# EAGLE design LPC_AP2_3_BOPLA PK 101-111.43 (EAGLE 5.06)
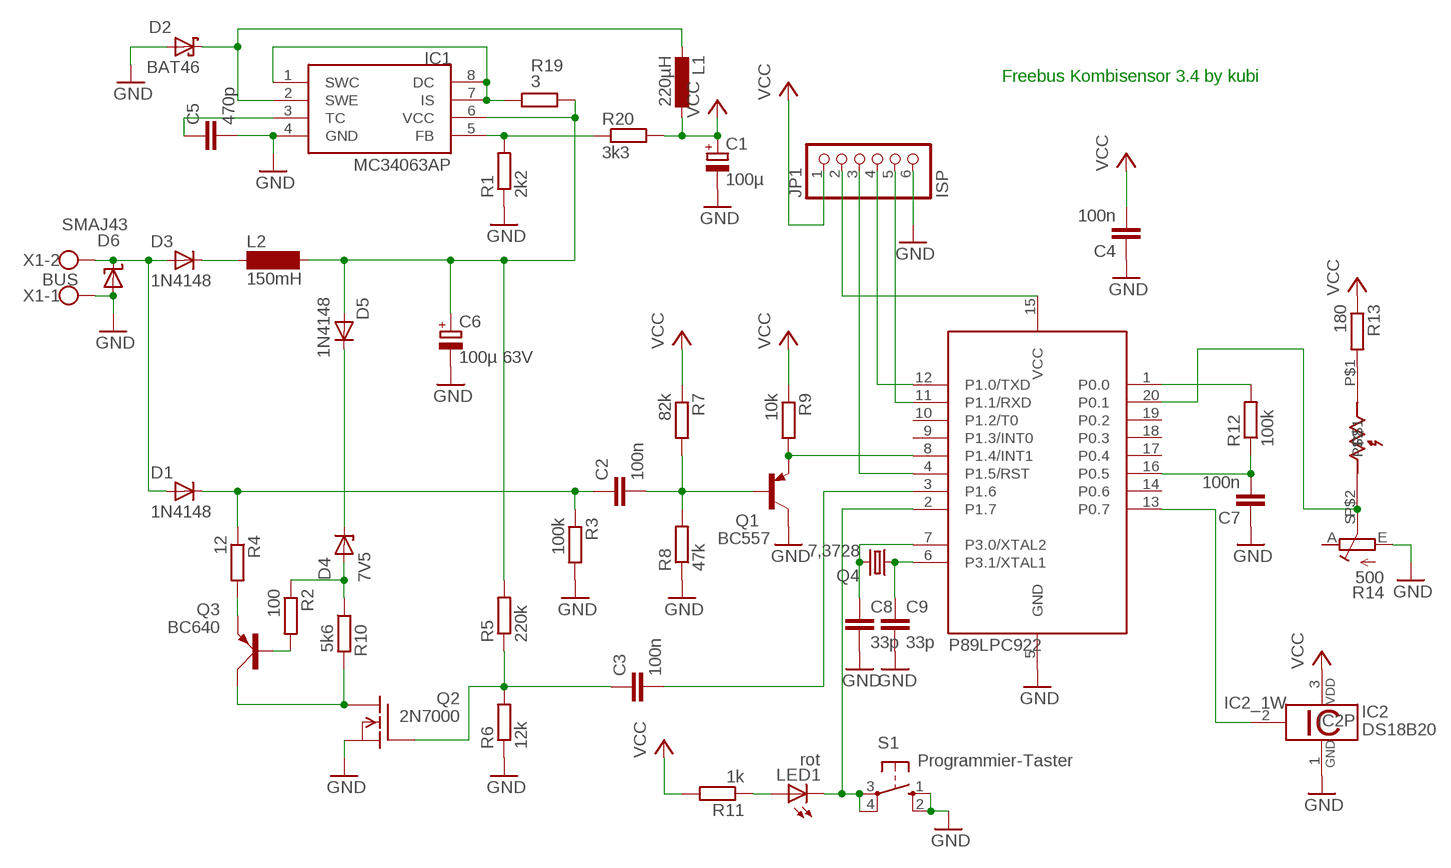
[diagram p0: schematic, sheet 1]

## Parts
C1  100µ  CPOL-EUE5-8.5  [E5-8,5]
C2  100n  C-EU050-024X044  [C050-024X044]
C3  100n  C-EU050-024X044  [C050-024X044]
C4  100n  C-EU050-024X044  [C050-024X044]
C5  470p  C-EU025-024X044  [C025-024X044]
C6  100µ 63V  CPOL-EUE5-8.5  [E5-8,5]
C7  100n  C-EU050-024X044  [C050-024X044]
C8  33p  C-EU025-024X044  [C025-024X044]
C9  33p  C-EU025-024X044  [C025-024X044]
D1  1N4148  DO35-LIEGEND  [DO35-L@1]
D2  BAT46  DO35S-STEHEND  [DO35S-S]
D3  1N4148  DO35-L  [DO35-L]
D4  7V5  DO35Z-L  [DO35Z-L]
D5  1N4148  DO35-S  [DO35-S]
D6  SMAJ43  SUPPRESSOR-SMBJ  [SMBJ]
IC1  MC34063AP  [DIL08]
IC2  DS18B20  [TO92-]
JP1  ISP  PINHD-1X6  [1X06]
L1  220µH  L-EU2200-12.7  [2200-12.7]
L2  150mH  SD12K100  [SD12K100]
LED1  rot  LED3MM  [LED3MM]
Q1  BC557  [TO92]
Q2  2N7000  VN2222KM  [TO237]
Q3  BC640  [SOT54D]
Q4  7,3728  CRYSTALHC49S  [HC49/S]
R1  2k2  R-EU_0207/2V  [0207/2V]
R2  100  R-EU_0207/2V  [0207/2V]
R3  100k  R-EU_0207/2V  [0207/2V]
R4  12  R-EU_0207/2V  [0207/2V]
R5  220k  R-EU_0207/2V  [0207/2V]
R6  12k  R-EU_0207/2V  [0207/2V]
R7  82k  R-EU_0207/2V  [0207/2V]
R8  47k  R-EU_0207/2V  [0207/2V]
R9  10k  R-EU_0207/2V  [0207/2V]
R10  5k6  R-EU_0207/2V  [0207/2V]
R11  1k  R-EU_0207/2V  [0207/2V]
R12  100k  R-EU_0204/7  [0204/7]
R13  180  R-EU_0207/2V  [0207/2V]
R14  500  R-TRIMM-PT6L  [PT6L]
R19  3  R-EU_0207/2V  [0207/2V]
R20  3k3  R-EU_0207/10  [0207/10]
S1  Programmier-Taster  10-XX  [B3F-10XX]
U1  89LPC922  [DIL20]
U$2  LDR07  [LDR07]
X1  BUS  W237-02P  [W237-132]

## Nets
GND: C1.- C4.1 C5.2 C6.- C7.1 C8.2 C9.2 D2.A D6.A IC1.4(GND) IC2.1 JP1.6 Q1.3(C) Q2.3(S) R1.1 R3.2 R6.1 R8.1 R14.E S1.1(S) S1.2(S1) U1.5(GND) X1.1
N$1: Q1.1(E) R9.2 U1.8(P1.4/INT1)
N$2: C2.2 Q1.2(B) R7.2 R8.2
N$3: IC1.5(FB) R1.2 R20.1
N$4: IC1.1(SWC) IC1.7(IS) IC1.8(DC) R19.1
N$5: C3.2 U1.3(P1.6)
N$6: Q2.1(D) Q3.C R10.2
N$7: C6.+ D5.A IC1.6(VCC) L2.2 R5.2 R19.2
N$8: D3.K L2.1
N$9: C2.1 D1.P$2(B) R3.1 R4.1
N$10: D2.K IC1.2(SWE) L1.2
N$11: D4.A R2.1 R10.1
N$12: Q3.E R4.2
N$13: C5.1 IC1.3(TC)
N$14: Q3.B R2.2
N$15: D1.P$1(A) D3.A D6.C X1.2
N$16: R13.2 U$2.P$1
N$17: LED1.K(C) S1.3(P) S1.4(P1) U1.2(P1.7)
N$18: R14.S U1.20(P0.1) U$2.P$2
N$19: IC2.2 U1.13(P0.7)
N$20: C8.1 Q4.2 U1.7(P3.0/XTAL2)
N$21: C9.1 Q4.1 U1.6(P3.1/XTAL1)
N$22: JP1.2 U1.15(VCC)
N$23: JP1.5 U1.11(P1.1/RXD)
N$24: JP1.4 U1.12(P1.0/TXD)
N$31: JP1.3 U1.4(P1.5/RST)
N$34: C3.1 Q2.2(G) R5.1 R6.2
N$40: D4.K D5.K
N$41: LED1.A R11.1
P0.0: R12.2 U1.1(P0.0)
P0.5: C7.2 R12.1 U1.16(P0.5)
VCC: C1.+ C4.2 IC2.3 JP1.1 L1.1 R7.1 R9.1 R11.2 R13.1 R20.2
Unconnected: R14.A U1.9(P1.3/INT0) U1.10(P1.2/T0) U1.14(P0.6) U1.17(P0.4) U1.18(P0.3) U1.19(P0.2)

## Notes on the sheet
- Freebus Kombisensor 3.4 by kubi
- P89LPC922

## Library data of the parts
C1 C6 = rcl:CPOL-EU: POLARIZED CAPACITOR, European symbol
C2-C5 C7-C9 = rcl:C-EU: CAPACITOR, European symbol
D1 = kubi:DO35-LIEGEND
D2 = kubi:DO35S-STEHEND
D3 D5 = kubi:DO35
D4 = kubi:DO35Z
D6 = diode:SUPPRESSOR-: Suppressor diode
IC1 = mc34063:MC34063
IC2 = 1wire:DS18B20: Programmable Resolution Digital Thermometer This chip provides a onewire thermosensor with approx. 0.5°C accuracy. A programmable over/undertemperure alarm is available. The precision can be set from 9..12 bits. Notes: Vdd must be applied for accurate measurements at low temperatures, as the parasite power circuit otherwise heats the sensor. If parasite power is used, Vdd has to be connected to GND. The DS1822 is a low-cost thermometer chip, the DS18S20 is similar to the DS18B20, but with 9 Bit precision only. Author: Jan Kandziora <jjj@gmx.de>
JP1 = pinhead:PINHD-1X6: PIN HEADER
L1 = rcl:L-EU: INDUCTOR, European symbol
L2 = inductor-neosid:SD12: INDUCTOR nominal inductance
LED1 = led:LED: LED OSRAM: - CHIPLED LG R971, LG N971, LY N971, LG Q971, LY Q971, LO R971, LY R971 LH N974, LH R974 LS Q976, LO Q976, LY Q976 LO Q996 - Hyper CHIPLED LW Q18S LB Q993, LB Q99A, LB R99A - SideLED LS A670, LO A670, LY A670, LG A670, LP A670 LB A673, LV A673, LT A673, LW A673 LH A674 LY A675 LS A676, LA A676, LO A676, LY A676, LW A676 LS A679, LY A679, LG A679 - Hyper Micro SIDELED® LS Y876, LA Y876, LO Y876, LY Y876 LT Y87S - SmartLED LW L88C, LW L88S LB L89C, LB L89S, LG L890 LS L89K, LO L89K, LY L89K LS L896, LA L896, LO L896, LY L896 - TOPLED LS T670, LO T670, LY T670, LG T670, LP T670 LSG T670, LSP T670, LSY T670, LOP T670, LYG T670 LG T671, LOG T671, LSG T671 LB T673, LV T673, LT T673, LW T673 LH T674 LS T676, LA T676, LO T676, LY T676, LB T676, LH T676, LSB T676, LW T676 LB T67C, LV T67C, LT T67C, LS T67K, LO T67K, LY T67K, LW E67C LS E67B, LA E67B, LO E67B, LY E67B, LB E67C, LV E67C, LT E67C LW T67C LS T679, LY T679, LG T679 LS T770, LO T770, LY T770, LG T770, LP T770 LB T773, LV T773, LT T773, LW T773 LH T774 LS E675, LA E675, LY E675, LS T675 LS T776, LA T776, LO T776, LY T776, LB T776 LHGB T686 LT T68C, LB T68C - Hyper Mini TOPLED® LB M676 - Mini TOPLED Santana® LG M470 LS M47K, LO M47K, LY M47K Source: http://www.osram.convergy.de - LUMILED® LXK2-PW12-R00, LXK2-PW12-S00, LXK2-PW14-U00, LXK2-PW14-V00 LXK2-PM12-R00, LXK2-PM12-S00, LXK2-PM14-U00 LXK2-PE12-Q00, LXK2-PE12-R00, LXK2-PE12-S00, LXK2-PE14-T00, LXK2-PE14-U00 LXK2-PB12-K00, LXK2-PB12-L00, LXK2-PB12-M00, LXK2-PB14-N00, LXK2-PB14-P00, LXK2-PB14-Q00 LXK2-PR12-L00, LXK2-PR12-M00, LXK2-PR14-Q00, LXK2-PR14-R00 LXK2-PD12-Q00, LXK2-PD12-R00, LXK2-PD12-S00 LXK2-PH12-R00, LXK2-PH12-S00 LXK2-PL12-P00, LXK2-PL12-Q00, LXK2-PL12-R00 Source: www.luxeon.com
Q1 = transistor-pnp:BC557: PNP Transistor
Q2 = transistor-fet:VN2222KM: N-Channel Enhancement MOSFET (VMOS); 60V; 0,5A; 7,5Ohm
Q3 = transistor-small-signal:BC640: PNP TRANSISTOR
Q4 = crystal:CRYSTAL: CRYSTAL
R1-R13 R19 R20 = rcl:R-EU_: RESISTOR, European symbol
R14 = kubi:R-TRIMM
S1 = switch-omron:10-XX: OMRON SWITCH
U1 = micro-philips:89LPC922
U$2 = ldr:LDR07
X1 = con-wago-508:W237-02P: WAGO SREW CLAMP

## Board
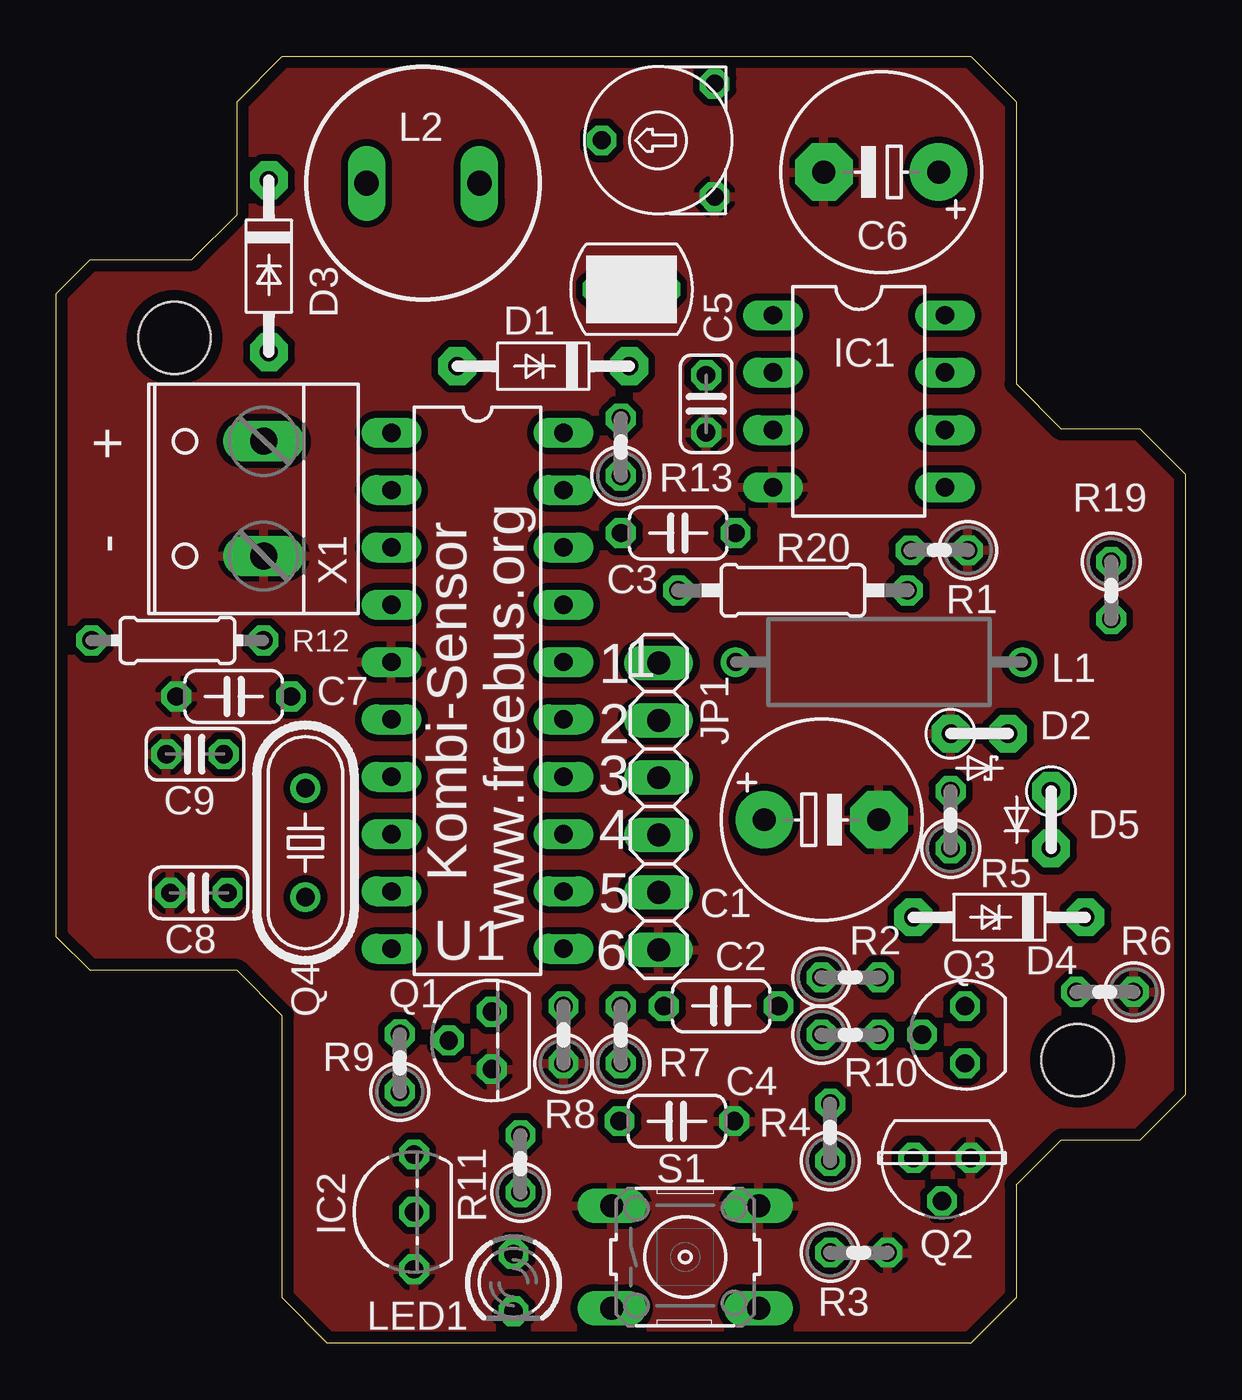
[diagram p1: board, top side]
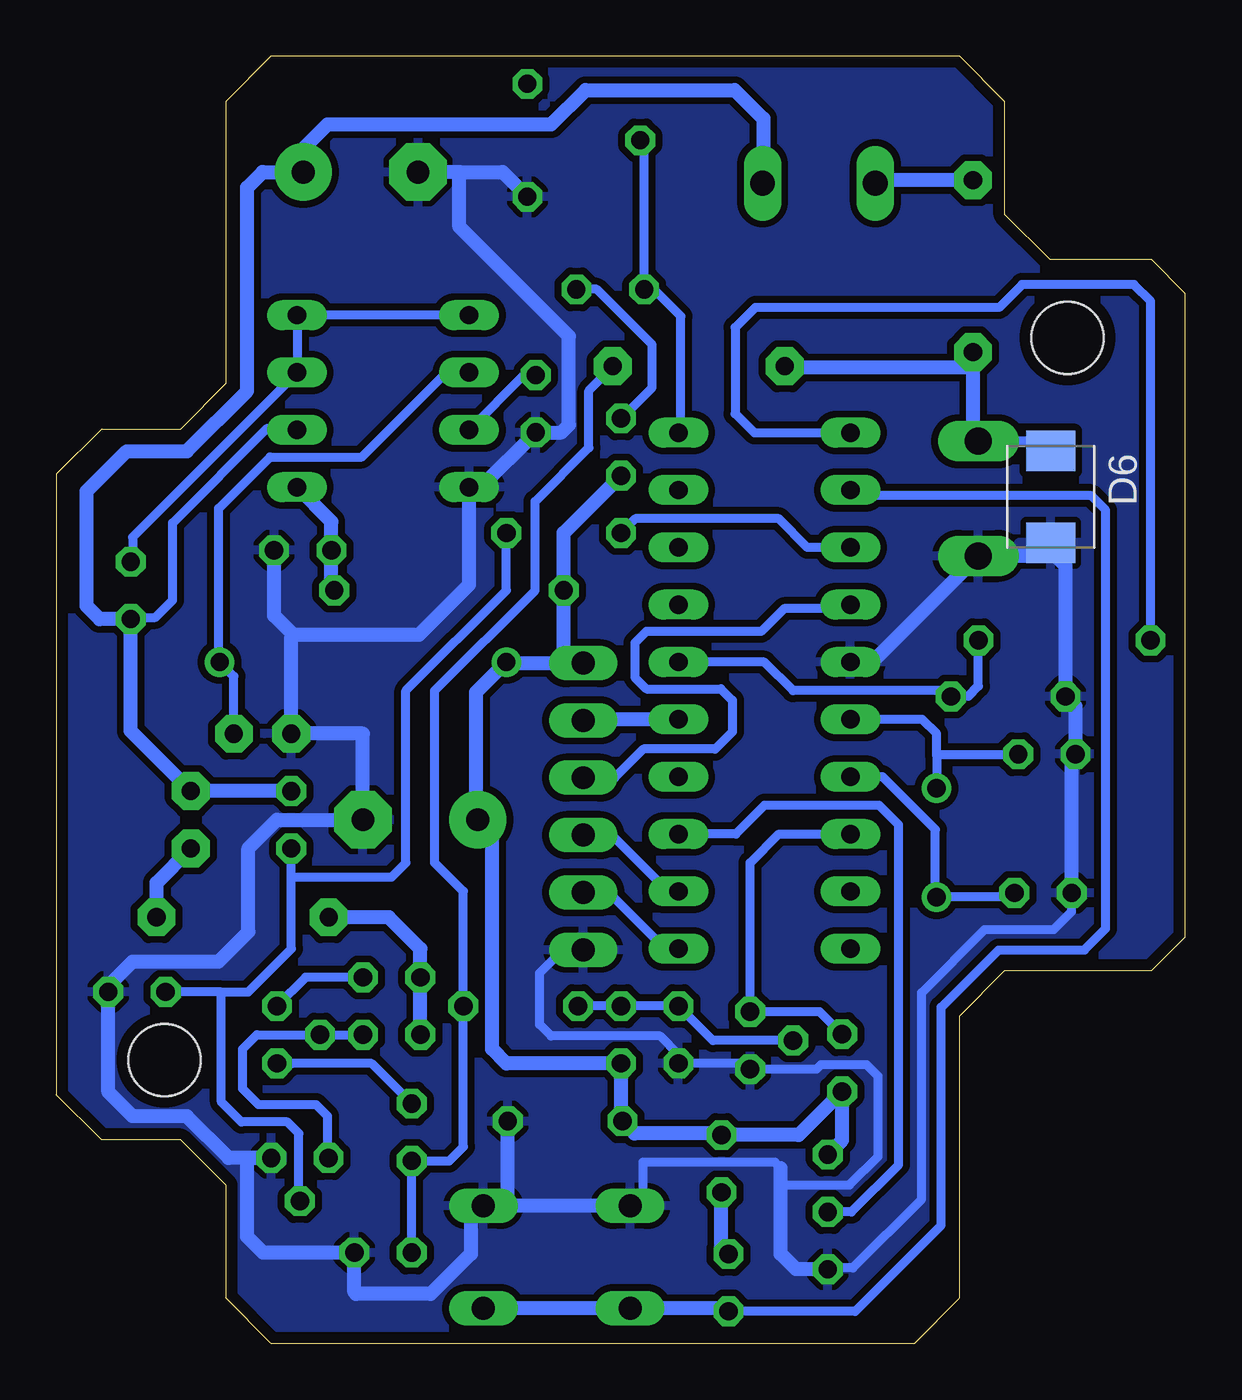
[diagram p2: board, bottom side, seen from below]

Size 50 x 57 mm. Coordinates in mm from the lower left corner, seen from the top.
Outline: 48,40.5 44.5,40.5 42.5,42.5 42.5,55 40.5,57 10,57 8,55 8,50 6,48 1.5,48 0,46.5 0,18 1.5,16.5 8,16.5 10,14.5 10,2 12,0 40.5,0 42.5,2 42.5,7 44.5,9 48,9 50,11 50,38.5 48,40.5
Copper layers (1*16): Top 0.035mm / dielectric 1.5mm / Bottom 0.035mm
Design rules "default *": minimum track width 10mil, minimum drill 24mil, track to track 12mil, track to pad 12mil, pad to pad 12mil, via to via 12mil, smd to smd 8mil, copper to edge 20mil, drill to drill 8mil, minimum pad ring 10mil, minimum via ring 8mil, stop-mask expansion 4mil, vias tented up to drill 0mil, thermal gap 10mil
Holes 3.2 mm at 5.22,44.54 45.23,12.54

### Footprints (pad centres in the part's own frame; a part is rotated, then mirrored left to right if it is on the bottom)
E5-8,5 = drill 1.016 pad 2.54 round: + -2.54,0 | drill 1.016 pad 2.54 octagon: - 2.54,0
C050-024X044 = drill 0.813 octagon: 1 -2.54,0; 2 2.54,0
C025-024X044 = drill 0.813 octagon: 1 -1.27,0; 2 1.27,0
DO35-L@1 = drill 0.8 pad 1.676 octagon: P$1 -3.81,0; P$2 3.81,0
DO35S-S = drill 0.8 pad 1.676 octagon: A -1.27,0; K 1.27,0
DO35-L = drill 0.8 pad 1.676 octagon: A -3.81,0; K 3.81,0
DO35Z-L = drill 0.8 pad 1.676 octagon: A -3.81,0; K 3.81,0
DO35-S = drill 0.8 pad 1.676 octagon: A -1.27,0; K 1.27,0
SMBJ = smd 1.78 x 2.16: A 2.04,0; C -2.03,0
DIL08 = drill 0.813 long: 1 -3.81,-3.81; 2 -1.27,-3.81; 3 1.27,-3.81; 4 3.81,-3.81; 5 3.81,3.81; 6 1.27,3.81; 7 -1.27,3.81; 8 -3.81,3.81
TO92- = drill 0.813 octagon: 1 -2.54,0; 2 0,0; 3 2.54,0
1X06 = drill 1.016 long: 1 -6.35,0; 2 -3.81,0; 3 -1.27,0; 4 1.27,0; 5 3.81,0; 6 6.35,0
2200-12.7 = drill 0.8 pad 1.27 round: 1 -6.35,0; 2 6.35,0
SD12K100 = drill 1.1 long: 1 -2.5,0; 2 2.5,0
LED3MM = drill 0.813 octagon: A -1.27,0; K 1.27,0
TO92 = drill 0.813 octagon: 1 1.27,0; 2 0,1.905; 3 -1.27,0
TO237 = drill 0.813 octagon: 1 1.27,0; 2 0,1.905; 3 -1.27,0
SOT54D = drill 0.813 octagon: B 1.27,0; C 0,1.905; E -1.27,0
HC49/S = drill 0.813 round: 1 -2.413,0; 2 2.413,0
0207/2V = drill 0.813 octagon: 1 -1.27,0; 2 1.27,0
0204/7 = drill 0.813 octagon: 1 -3.81,0; 2 3.81,0
PT6L = drill 0.8 octagon: A 2.5,2.5; E 2.5,-2.5; S -2.5,0
0207/10 = drill 0.813 octagon: 1 -5.08,0; 2 5.08,0
B3F-10XX = drill 1.016 long: 1 -3.251,2.261; 2 3.251,2.261; 3 -3.251,-2.261; 4 3.251,-2.261
DIL20 = drill 0.813 long: 1 -11.43,-3.81; 2 -8.89,-3.81; 3 -6.35,-3.81; 4 -3.81,-3.81; 5 -1.27,-3.81; 6 1.27,-3.81; 7 3.81,-3.81; 8 6.35,-3.81; 9 8.89,-3.81; 10 11.43,-3.81; 11 11.43,3.81; 12 8.89,3.81; 13 6.35,3.81; 14 3.81,3.81; 15 1.27,3.81; 16 -1.27,3.81; 17 -3.81,3.81; 18 -6.35,3.81; 19 -8.89,3.81; 20 -11.43,3.81
LDR07 = drill 0.8 octagon: P$1 -1.5,0; P$2 1.5,0
W237-132 = drill 1.194 long: 1 -2.54,-0.635; 2 2.54,-0.635

### Placement (x,y rotation side)
C1  33.89,23.18 0 top
C2  29.44,14.93 180 top
C3  27.54,35.88 180 top
C4  27.47,9.83 180 top
C5  28.77,41.62 270 top
C6  36.53,51.88 180 top
C7  7.85,28.65 0 top
C8  6.31,19.94 180 top
C9  6.14,26.09 180 top
D1  21.56,43.27 0 top
D2  40.87,27 0 top
D3  9.41,47.7 90 top
D4  41.76,18.87 0 top
D5  44.05,23.18 270 top
D6  5.97,37.49 270 bottom
IC1  35.54,41.73 270 top
IC2  15.84,5.81 90 top
JP1  26.67,23.78 270 top
L1  36.43,30.17 0 top
L2  16.23,51.38 0 top
LED1  20.24,2.67 270 top
Q1  19.28,13.41 90 top
Q2  39.22,8.2 180 top
Q3  40.24,13.66 90 top
Q4  11.03,22.17 270 top
R1  39.09,35.12 180 top
R2  35.16,16.2 0 top
R3  35.54,4.01 0 top
R4  34.27,9.34 90 top
R5  39.6,23.18 90 top
R6  46.43,15.56 180 top
R7  25,13.66 90 top
R8  22.45,13.66 90 top
R9  15.21,12.41 90 top
R10  35.16,13.66 0 top
R11  20.55,7.95 90 top
R12  5.36,31.13 180 top
R13  25,39.7 90 top
R14  26.65,53.28 0 top
R19  46.71,33.34 270 top
R20  32.62,33.34 180 top
S1  27.84,3.81 0 top
U1  18.64,28.9 270 top
U$2  25.47,46.68 180 top
X1  8.54,37.41 90 top

### Tracks (layer width: path | path; a pad name or v marks a point on that pad's centre or on a via)
GND
  Bottom 0.406: 24.03,6.07 24.03,8.02 18.18,8.02 17.93,7.76 | 17.93,6.75 17.68,7 14.88,7 13.61,8.27 13.61,11.83 14.12,12.33 16.15,12.33 16.35,12.14 Q1.3 19.53,12.39 R8.1 22.45,12.79 23.26,13.6 28.09,13.6 28.6,14.11 28.6,16.4 27.57,17.43 JP1.6 | C8.2 5.04,19.12 5.84,18.32 8.89,18.32 11.68,15.52 11.68,6.38 14.73,3.33 15.78,3.33 IC2.1 | D6.A 6.15,35.45 6.73,34.87
  Bottom 0.61: 29.97,6.07 S1.1 24.03,6.07 | 29.97,6.07 S1.2 31.65,5.52 31.65,3.95 33.42,2.17 36.73,2.17 36.81,2.25 R3.2 40.85,4.01 41.55,4.71 41.55,8.2 Q2.3 42.37,8.2 44.22,10.05 46.63,10.05 47.7,11.12 R6.1 47.65,15.61 47.65,15.89 46.63,16.91 42.82,16.91 41.51,18.22 41.51,21.91 40.24,23.18 C1.- 36.43,27 D2.A 39.6,31.3 39.52,31.38 | 39.52,31.38 40.36,32.23 R1.1 | R14.E 30.24,51.88 32.15,51.88 | 32.15,51.88 C6.- | 17.93,7.76 17.93,6.75 17.93,3.95 17.25,3.27 IC2.1 | U1.5 13.87,30.17 X1.1 6.73,34.87 5.74,34.87 5.31,34.43 5.31,30.81 5.31,30.8 C7.1 4.87,28.21 C9.2 5.04,25.92 C8.2 | 32.15,51.88 32.15,49.45 27.3,44.61 27.3,40.68 27.64,40.34 C5.2 31.2,37.92 IC1.4 31.73,33.6 33.94,31.38 39.52,31.38 | C4.1 30.01,6.11 29.97,6.07
  pour Bottom: 0.13,17.81 1.27,16.66 1.4,16.66 1.78,16.28 8,16.28 9.65,14.63 9.65,2.19 12.06,-0.23 40.51,-0.23 42.67,1.93 42.67,7.01 44.45,8.79 47.75,8.79 50.17,11.2 50.17,38.51 47.88,40.8 44.32,40.8 42.8,42.32 42.8,54.51 40.26,57.05 10.29,57.05 8.25,55.02 7.75,54.51 7.75,49.56 6.22,48.03 1.4,48.03 0.25,46.89 0.13,45.11
  pour Top: 10.03,56.67 8,54.64 8,49.94 5.97,47.91 1.78,47.91 0.25,46.38 0.25,17.68 1.65,16.28 8.51,16.28 10.41,14.38 10.41,1.42 11.81,0.03 40.26,0.03 42.55,2.31 42.55,7.01 44.7,9.17 48.13,9.17 50.04,11.08 50.04,38.38 47.88,40.54 44.45,40.54 42.42,42.57 42.42,54.64 40.13,56.92
N$1
  Bottom 0.406: U1.8 18.01,22.55 19.28,21.28 Q1.1 16.2,14.68 R9.2
N$2
  Bottom 0.406: C2.2 R7.2 R8.2 20.93,13.41 Q1.2
N$3
  Bottom 0.61: R20.1 37.82,33.47 R1.2 37.82,36.39 IC1.5
N$4
  Bottom 0.406: IC1.1 IC1.8 IC1.7 46.63,35.7 46.63,34.7 R19.1
N$5
  Bottom 0.406: U1.3 16.74,35.25 18.01,36.52 24.36,36.52 C3.2
N$6
  Bottom 0.406: R10.2 Q3.C 41.12,13.66 41.76,13.03 41.76,11.27 41.04,10.56 38.5,10.56 38,10.05 38,8.25 Q2.1
N$7
  Bottom 0.406: IC1.6 39.85,40.46 39.92,40.53 40.66,40.53 44.85,36.34 44.85,32.91 45.62,32.15 46.64,32.15
  Bottom 0.61: R5.2 D5.A 46.71,27.12 R19.2 | R19.2 46.64,32.15 | R19.2 48.09,32.08 48.66,32.65 48.66,37.73 46.89,39.51 44.22,39.51 41.55,42.18 41.55,51.2 40.87,51.88 C6.+ 39.07,52.92 38,53.99 28.09,53.99 26.57,55.51 19.96,55.51 18.69,54.24 18.69,51.42 L2.2
N$8
  Bottom 0.61: D3.K 13.73,51.52 L2.1
N$9
  Bottom 0.406: R3.1 R4.1 32.61,8.07 31.98,8.7 C2.1 31.98,20.01 33.25,21.28 33.25,28.9 28.8,33.34 28.8,37.28 26.42,39.67 26.42,42.19 25.37,43.24 D1.P$2
N$10
  Bottom 0.406: D2.K 42.14,29.54 L1.2 42.82,30.22 42.82,36.97 40.54,39.26 36.47,39.26 32.73,43 IC1.2
N$11
  Bottom 0.61: R10.1 R2.1 33.89,17.47 35.28,18.87 D4.A
N$12
  Bottom 0.406: 39.58,12.39 Q3.E 36.04,12.39 R4.2
N$13
  Bottom 0.406: IC1.3 29.3,42.88 C5.1
N$14
  Bottom 0.406: R2.2 38.97,16.2 Q3.B
N$15
  Bottom 0.406: X1.2 6.39,39.95 D6.C
  Bottom 0.61: X1.2 9.41,39.95 9.41,43.21 | 9.41,43.21 D3.A | D1.P$1 17.68,43.21 9.41,43.21
N$16
  Bottom 0.406: R13.2 23.62,42.34 23.62,44.22 26.08,46.68 U$2.P$1
N$17
  Bottom 0.406: LED1.K 14.63,1.4 10.82,5.22 10.82,14.87 8.28,17.41 4.48,17.41 3.53,18.36 3.53,36.9 4.17,37.54 14.58,37.54 U1.2
  Bottom 0.61: S1.4 S1.3 20.38,1.55 LED1.K
N$18
  Bottom 0.406: U1.20 22.35,40.43 22.35,45.49 23.54,46.68 U$2.P$2 23.97,53.11 R14.S
N$19
  Bottom 0.406: U1.13 19.91,22.55 18.64,23.82 13.57,23.82 12.7,22.96 12.7,7.9 14.79,5.81 IC2.2
N$20
  Bottom 0.406: U1.7 13.41,25.09 11.07,22.75 11.07,19.8 Q4.2 7.76,19.76 C8.1
N$21
  Bottom 0.406: U1.6 11.66,27.63 11.03,27 11.03,26.05 | 11.03,26.05 Q4.1 | 11.03,26.05 7.45,26.05 C9.1
N$22
  Bottom 0.61: U1.15 26.63,27.63 JP1.2
N$23
  Bottom 0.406: U1.11 23.03,17.47 25.4,19.84 26.54,19.84 JP1.5
N$24
  Bottom 0.406: U1.12 22.9,20.01 25.4,22.51 JP1.4
N$31
  Bottom 0.406: JP1.3 25.27,25.05 24,26.32 20.83,26.32 20.07,27.08 20.07,28.48 20.57,28.98 23.88,28.98 24.38,29.49 24.38,31.02 23.88,31.52 18.8,31.52 17.78,32.54 15,32.54 U1.4
N$34
  Bottom 0.406: C3.1 30.07,33.34 34.52,28.9 34.52,21.28 35.16,20.64 39.6,20.64 | 39.6,20.64 39.6,17.47 41.51,15.56 42.7,15.56 | 39.6,20.64 R5.1 | Q2.2 39.27,6.34 39.27,9.29 39.77,9.79 41.81,9.79 42.7,10.68 42.7,15.56 | 42.7,15.56 R6.2
N$40
  Bottom 0.61: D5.K 45.57,20.39 D4.K
N$41
  Bottom 0.61: LED1.A 20.55,4.26 R11.1
P0.0
  Bottom 0.406: U1.1 19.09,40.33 19.94,41.18 19.94,44.99 19.05,45.88 8.25,45.88 7.24,46.89 2.29,46.89 1.55,46.15 R12.2
P0.5
  Bottom 0.406: U1.16 18.64,30.17 17.38,28.9 10.64,28.9 C7.2 9.62,28.65 9.17,29.1 R12.1
VCC
  Bottom 0.406: R11.2 20.55,9.54
  Bottom 0.61: R13.1 27.54,35.88 R20.2 27.54,30.28 27.69,30.13 | IC2.3 15.21,8.99 R9.1 17.14,9.21 R11.2 20.62,9.29 24.39,9.29 C4.2 25,9.89 R7.1 30.07,12.39 30.71,13.03 30.71,22.55 C1.+ 31.41,23.25 31.41,28.83 L1.1 | 27.69,30.13 30.07,30.13 L1.1 | 27.69,30.13 JP1.1 | L1.1 30.12,30.17

### Text on the board
tNames: + | - | 1 | 1 | 2 | 3 | 4 | Kombi-Sensor | 5 | www.freebus.org | 6